# Altium schematic sheet BTB CONNECTOR.SchDoc
size A3
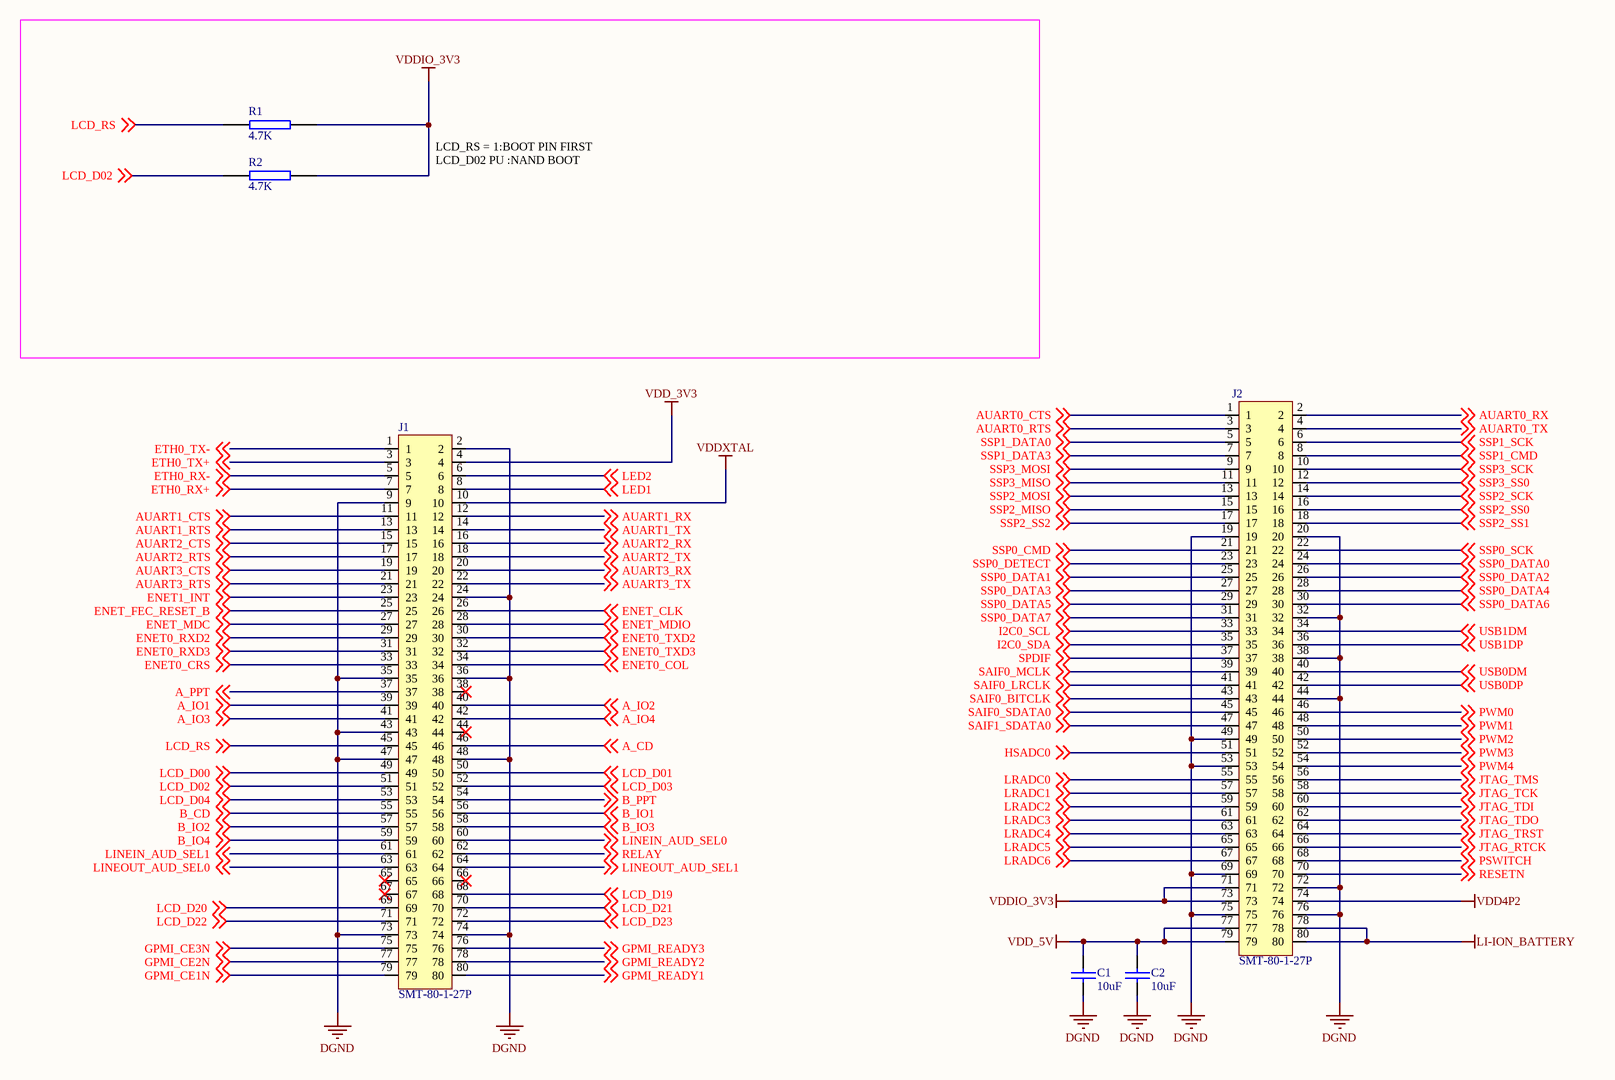
[diagram p0: BTB CONNECTOR.SchDoc]

## Parts
C1  10uF  [C0805]
C2  10uF  [C0805]
J1  SMT-80-1-27P  [DB40X2-1.27]
J2  SMT-80-1-27P  [DB40X2-1.27]
R1  4.7K  [0603]
R2  4.7K  [0603]

## Nets
DGND: C1.2 C2.2 J1.2 J1.9 J1.24 J1.35 J1.36 J1.43 J1.47 J1.48 J1.73 J1.74 J2.19 J2.20 J2.32 J2.38 J2.44 J2.49 J2.53 J2.69 J2.72 J2.75 J2.76
LI-ION_BATTERY: J2.78 J2.80
VDD4P2: J2.74
VDD_3V3: J1.4
VDD_5V: C1.1 C2.1 J2.77 J2.79
VDDIO_3V3: J2.71 J2.73 R1.1 R2.1
VDDXTAL: J1.10
A_CD: J1.46 ; off-sheet A_CD
A_IO1: J1.39 ; off-sheet A_IO1
A_IO2: J1.40 ; off-sheet A_IO2
A_IO3: J1.41 ; off-sheet A_IO3
A_IO4: J1.42 ; off-sheet A_IO4
A_PPT: J1.37 ; off-sheet A_PPT
AUART0_CTS: J2.1 ; off-sheet AUART0_CTS
AUART0_RTS: J2.3 ; off-sheet AUART0_RTS
AUART0_RX: J2.2 ; off-sheet AUART0_RX
AUART0_TX: J2.4 ; off-sheet AUART0_TX
AUART1_CTS: J1.11 ; off-sheet AUART1_CTS
AUART1_RTS: J1.13 ; off-sheet AUART1_RTS
AUART1_RX: J1.12 ; off-sheet AUART1_RX
AUART1_TX: J1.14 ; off-sheet AUART1_TX
AUART2_CTS: J1.15 ; off-sheet AUART2_CTS
AUART2_RTS: J1.17 ; off-sheet AUART2_RTS
AUART2_RX: J1.16 ; off-sheet AUART2_RX
AUART2_TX: J1.18 ; off-sheet AUART2_TX
AUART3_CTS: J1.19 ; off-sheet AUART3_CTS
AUART3_RTS: J1.21 ; off-sheet AUART3_RTS
AUART3_RX: J1.20 ; off-sheet AUART3_RX
AUART3_TX: J1.22 ; off-sheet AUART3_TX
B_CD: J1.55 ; off-sheet B_CD
B_IO1: J1.56 ; off-sheet B_IO1
B_IO2: J1.57 ; off-sheet B_IO2
B_IO3: J1.58 ; off-sheet B_IO3
B_IO4: J1.59 ; off-sheet B_IO4
B_PPT: J1.54 ; off-sheet B_PPT
ENET0_COL: J1.34 ; off-sheet ENET0_COL
ENET0_CRS: J1.33 ; off-sheet ENET0_CRS
ENET0_RXD2: J1.29 ; off-sheet ENET0_RXD2
ENET0_RXD3: J1.31 ; off-sheet ENET0_RXD3
ENET0_TXD2: J1.30 ; off-sheet ENET0_TXD2
ENET0_TXD3: J1.32 ; off-sheet ENET0_TXD3
ENET1_INT: J1.23 ; off-sheet ENET1_INT
ENET_CLK: J1.26 ; off-sheet ENET_CLK
ENET_FEC_RESET_B: J1.25 ; off-sheet ENET_FEC_RESET_B
ENET_MDC: J1.27 ; off-sheet ENET_MDC
ENET_MDIO: J1.28 ; off-sheet ENET_MDIO
ETH0_RX+: J1.7 ; off-sheet ETH0_RX+
ETH0_RX-: J1.5 ; off-sheet ETH0_RX-
ETH0_TX+: J1.3 ; off-sheet ETH0_TX+
ETH0_TX-: J1.1 ; off-sheet ETH0_TX-
GPMI_CE1N: J1.79 ; off-sheet GPMI_CE1N
GPMI_CE2N: J1.77 ; off-sheet GPMI_CE2N
GPMI_CE3N: J1.75 ; off-sheet GPMI_CE3N
GPMI_READY1: J1.80 ; off-sheet GPMI_READY1
GPMI_READY2: J1.78 ; off-sheet GPMI_READY2
GPMI_READY3: J1.76 ; off-sheet GPMI_READY3
HSADC0: J2.51 ; off-sheet HSADC0
I2C0_SCL: J2.33 ; off-sheet I2C0_SCL
I2C0_SDA: J2.35 ; off-sheet I2C0_SDA
JTAG_RTCK: J2.66 ; off-sheet JTAG_RTCK
JTAG_TCK: J2.58 ; off-sheet JTAG_TCK
JTAG_TDI: J2.60 ; off-sheet JTAG_TDI
JTAG_TDO: J2.62 ; off-sheet JTAG_TDO
JTAG_TMS: J2.56 ; off-sheet JTAG_TMS
JTAG_TRST: J2.64 ; off-sheet JTAG_TRST
LCD_D00: J1.49 ; off-sheet LCD_D00
LCD_D01: J1.50 ; off-sheet LCD_D01
LCD_D02: J1.51 R2.2 ; off-sheet LCD_D02
LCD_D03: J1.52 ; off-sheet LCD_D03
LCD_D04: J1.53 ; off-sheet LCD_D04
LCD_D19: J1.68 ; off-sheet LCD_D19
LCD_D20: J1.69 ; off-sheet LCD_D20
LCD_D21: J1.70 ; off-sheet LCD_D21
LCD_D22: J1.71 ; off-sheet LCD_D22
LCD_D23: J1.72 ; off-sheet LCD_D23
LCD_RS: J1.45 R1.2 ; off-sheet LCD_RS
LED1: J1.8 ; off-sheet LED1
LED2: J1.6 ; off-sheet LED2
LINEIN_AUD_SEL0: J1.60 ; off-sheet LINEIN_AUD_SEL0
LINEIN_AUD_SEL1: J1.61 ; off-sheet LINEIN_AUD_SEL1
LINEOUT_AUD_SEL0: J1.63 ; off-sheet LINEOUT_AUD_SEL0
LINEOUT_AUD_SEL1: J1.64 ; off-sheet LINEOUT_AUD_SEL1
LRADC0: J2.55 ; off-sheet LRADC0
LRADC1: J2.57 ; off-sheet LRADC1
LRADC2: J2.59 ; off-sheet LRADC2
LRADC3: J2.61 ; off-sheet LRADC3
LRADC4: J2.63 ; off-sheet LRADC4
LRADC5: J2.65 ; off-sheet LRADC5
LRADC6: J2.67 ; off-sheet LRADC6
PSWITCH: J2.68 ; off-sheet PSWITCH
PWM0: J2.46 ; off-sheet PWM0
PWM1: J2.48 ; off-sheet PWM1
PWM2: J2.50 ; off-sheet PWM2
PWM3: J2.52 ; off-sheet PWM3
PWM4: J2.54 ; off-sheet PWM4
RELAY: J1.62 ; off-sheet RELAY
RESETN: J2.70 ; off-sheet RESETN
SAIF0_BITCLK: J2.43 ; off-sheet SAIF0_BITCLK
SAIF0_LRCLK: J2.41 ; off-sheet SAIF0_LRCLK
SAIF0_MCLK: J2.39 ; off-sheet SAIF0_MCLK
SAIF0_SDATA0: J2.45 ; off-sheet SAIF0_SDATA0
SAIF1_SDATA0: J2.47 ; off-sheet SAIF1_SDATA0
SPDIF: J2.37 ; off-sheet SPDIF
SSP0_CMD: J2.21 ; off-sheet SSP0_CMD
SSP0_DATA0: J2.24 ; off-sheet SSP0_DATA0
SSP0_DATA1: J2.25 ; off-sheet SSP0_DATA1
SSP0_DATA2: J2.26 ; off-sheet SSP0_DATA2
SSP0_DATA3: J2.27 ; off-sheet SSP0_DATA3
SSP0_DATA4: J2.28 ; off-sheet SSP0_DATA4
SSP0_DATA5: J2.29 ; off-sheet SSP0_DATA5
SSP0_DATA6: J2.30 ; off-sheet SSP0_DATA6
SSP0_DATA7: J2.31 ; off-sheet SSP0_DATA7
SSP0_DETECT: J2.23 ; off-sheet SSP0_DETECT
SSP0_SCK: J2.22 ; off-sheet SSP0_SCK
SSP1_CMD: J2.8 ; off-sheet SSP1_CMD
SSP1_DATA0: J2.5 ; off-sheet SSP1_DATA0
SSP1_DATA3: J2.7 ; off-sheet SSP1_DATA3
SSP1_SCK: J2.6 ; off-sheet SSP1_SCK
SSP2_MISO: J2.15 ; off-sheet SSP2_MISO
SSP2_MOSI: J2.13 ; off-sheet SSP2_MOSI
SSP2_SCK: J2.14 ; off-sheet SSP2_SCK
SSP2_SS0: J2.16 ; off-sheet SSP2_SS0
SSP2_SS1: J2.18 ; off-sheet SSP2_SS1
SSP2_SS2: J2.17 ; off-sheet SSP2_SS2
SSP3_MISO: J2.11 ; off-sheet SSP3_MISO
SSP3_MOSI: J2.9 ; off-sheet SSP3_MOSI
SSP3_SCK: J2.10 ; off-sheet SSP3_SCK
SSP3_SS0: J2.12 ; off-sheet SSP3_SS0
USB0DM: J2.40 ; off-sheet USB0DM
USB0DP: J2.42 ; off-sheet USB0DP
USB1DM: J2.34 ; off-sheet USB1DM
USB1DP: J2.36 ; off-sheet USB1DP

Not connected (* = marked no-connect by the designer): J1 38* 44* 65* 66* 67*

## Notes on the sheet
- LCD_RS = 1:BOOT PIN FIRST
  LCD_D02 PU :NAND BOOT

## Library data of the parts
C1 C2 = CAP: Capacitor
R1 R2 = RES2